# Altium schematic sheet 1-Power.SchDoc
size A4; SheetNumber: 1; SheetTotal: 4
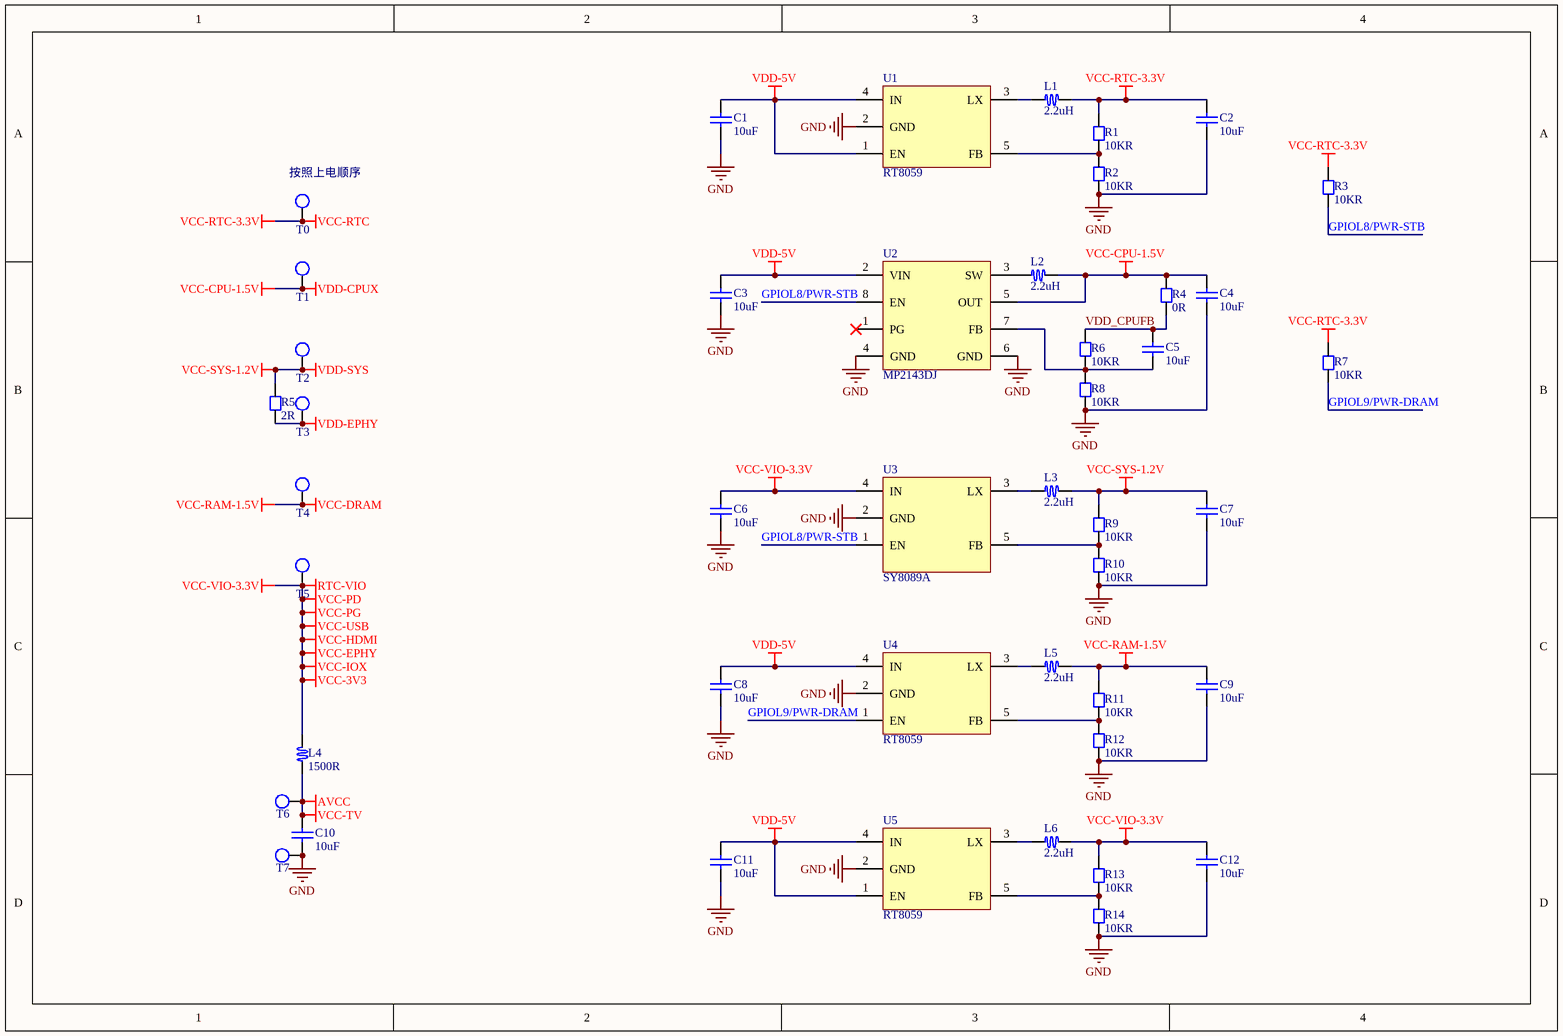
[diagram p0: 1-Power.SchDoc]

## Parts
C1  10uF  [CC1005-0402]
C2  10uF  [CC1005-0402]
C3  10uF  [CC1005-0402]
C4  10uF  [CC1005-0402]
C5  10uF  [CC1005-0402]
C6  10uF  [CC1005-0402]
C7  10uF  [CC1005-0402]
C8  10uF  [CC1005-0402]
C9  10uF  [CC1005-0402]
C10  10uF  [CC1005-0402]
C11  10uF  [CC1005-0402]
C12  10uF  [CC1005-0402]
L1  2.2uH  [Inductor-3010]
L2  2.2uH  [Inductor-4018]
L3  2.2uH  [Inductor-3010]
L4  1500R  [Inductor-0402]
L5  2.2uH  [Inductor-3010]
L6  2.2uH  [Inductor-3010]
R1  10KR  [CR1005-0402]
R2  10KR  [CR1005-0402]
R3  10KR  [CR1005-0402]
R4  0R  [CR1005-0402]
R5  2R  [CR1005-0402]
R6  10KR  [CR1005-0402]
R7  10KR  [CR1005-0402]
R8  10KR  [CR1005-0402]
R9  10KR  [CR1005-0402]
R10  10KR  [CR1005-0402]
R11  10KR  [CR1005-0402]
R12  10KR  [CR1005-0402]
R13  10KR  [CR1005-0402]
R14  10KR  [CR1005-0402]
T0  Test  [TEST]  (value not drawn)
T1  Test  [TEST]  (value not drawn)
T2  Test  [TEST]  (value not drawn)
T3  Test  [TEST]  (value not drawn)
T4  Test  [TEST]  (value not drawn)
T5  Test  [TEST]  (value not drawn)
T6  Test  [TEST]  (value not drawn)
T7  Test  [TEST]  (value not drawn)
U1  RT8059  [SOT23-5]
U2  MP2143DJ  [TSOT23-8]
U3  SY8089A  [SOT23-5]
U4  RT8059  [SOT23-5]
U5  RT8059  [SOT23-5]

## Nets
AVCC: C10.2 L4.1 T6.1  [also labelled VCC-TV]
GND: C1.1 C2.1 C3.1 C4.1 C6.1 C7.1 C8.1 C9.1 C10.1 C11.1 C12.1 R2.1 R8.1 R10.1 R12.1 R14.1 T7.1 U1.2(GND) U2.4(GND) U2.6(GND) U3.2(GND) U4.2(GND) U5.2(GND)
RTC-VIO: C6.2 C12.2 L4.2 L6.2 R13.2 T5.1 U3.4(IN)  [also labelled VCC-3V3, VCC-EPHY, VCC-HDMI, VCC-IOX, VCC-PD, VCC-PG, VCC-USB, VCC-VIO-3.3V]
VCC-CPU-1.5V: C4.2 L2.2 R4.2 T1.1 U2.5(OUT)  [also labelled VDD-CPUX]
VCC-DRAM: C9.2 L5.2 R11.2 T4.1  [also labelled VCC-RAM-1.5V]
VCC-RTC: C2.2 L1.2 R1.2 R3.2 R7.2 T0.1  [also labelled VCC-RTC-3.3V]
VCC-SYS-1.2V: C7.2 L3.2 R5.1 R9.2 T2.1  [also labelled VDD-SYS]
VDD-5V: C1.2 C3.2 C8.2 C11.2 U1.1(EN) U1.4(IN) U2.2(VIN) U4.4(IN) U5.1(EN) U5.4(IN)
VDD-EPHY: R5.2 T3.1
GPIOL8/PWR-STB: R3.1 U2.8(EN) U3.1(EN)
GPIOL9/PWR-DRAM: R7.1 U4.1(EN)
VDD_CPUFB: C5.2 R4.1 R6.2
NetC5_1: C5.1 R6.1 R8.2 U2.7(FB)
NetL1_1: L1.1 U1.3(LX)
NetL2_1: L2.1 U2.3(SW)
NetL3_1: L3.1 U3.3(LX)
NetL5_1: L5.1 U4.3(LX)
NetL6_1: L6.1 U5.3(LX)
NetR1_1: R1.1 R2.2 U1.5(FB)
NetR9_1: R9.1 R10.2 U3.5(FB)
NetR11_1: R11.1 R12.2 U4.5(FB)
NetR13_1: R13.1 R14.2 U5.5(FB)

Not connected (* = marked no-connect by the designer): U2 1(PG)*

## Notes on the sheet
- (near T0) 按照上电顺序

## Library data of the parts
C1-C12 = Chip capacitor: 贴片电容
L1-L6 = Chip inductor: 贴片电感
R1-R14 = Chip resistor: 贴片电阻
T0-T7 = Test: 测试点
U1 U4 U5 = RT8059: LDO 1A RICHTEK(台湾立锜)
U2 = MP2143DJ: DCDC 3A MPS公司（中文名称：芯源信息系统有限公司）
U3 = SY8089A: DCDC 2A